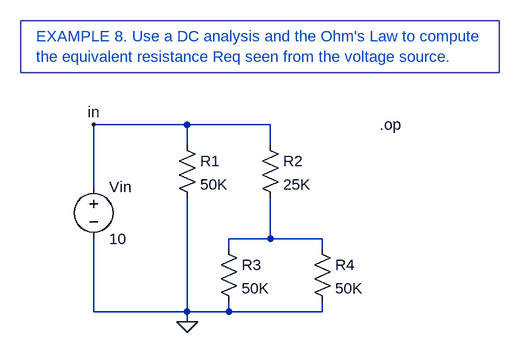
[diagram p0: schematic example-008.asc]
example-008.asc, the LTspice schematic file:
Version 4
SHEET 1 880 680
WIRE 16 -96 -128 -96
WIRE 144 -96 16 -96
WIRE 16 -64 16 -96
WIRE 144 -64 144 -96
WIRE -128 0 -128 -96
WIRE 144 80 144 16
WIRE 144 80 80 80
WIRE 224 80 144 80
WIRE 80 96 80 80
WIRE 224 96 224 80
WIRE -128 192 -128 80
WIRE 16 192 16 16
WIRE 16 192 -128 192
WIRE 80 192 80 176
WIRE 80 192 16 192
WIRE 224 192 224 176
WIRE 224 192 80 192
WIRE 16 208 16 192
FLAG 16 208 0
FLAG -128 -96 in
SYMBOL res 0 -80 R0
SYMATTR InstName R1
SYMATTR Value 50K
SYMBOL Res 128 -80 R0
SYMATTR InstName R2
SYMATTR Value 25K
SYMBOL Res 64 80 R0
SYMATTR InstName R3
SYMATTR Value 50K
SYMBOL Res 208 80 R0
SYMATTR InstName R4
SYMATTR Value 50K
SYMBOL voltage -128 -16 R0
SYMATTR InstName Vin
SYMATTR Value 10
TEXT 312 -96 Left 2 !.op
TEXT -216 -232 Left 2 ;EXAMPLE 8. Use a DC analysis and the Ohm's Law to compute\nthe equivalent resistance Req seen from the voltage source.
RECTANGLE Normal -240 -256 496 -176

The netlist it stands for:
* example-008.asc
R1 in 0 50K
R2 in N001 25K
R3 N001 0 50K
R4 N001 0 50K
Vin in 0 10
.op
* EXAMPLE 8. Use a DC analysis and the Ohm's Law to compute
* the equivalent resistance Req seen from the voltage source.
.backanno
.end